# Altium schematic sheet PE.SchDoc: Architecture Diagram For Geec Power Electronics
size A3; Author: Conor Farrell; SheetNumber: 1; SheetTotal: 6
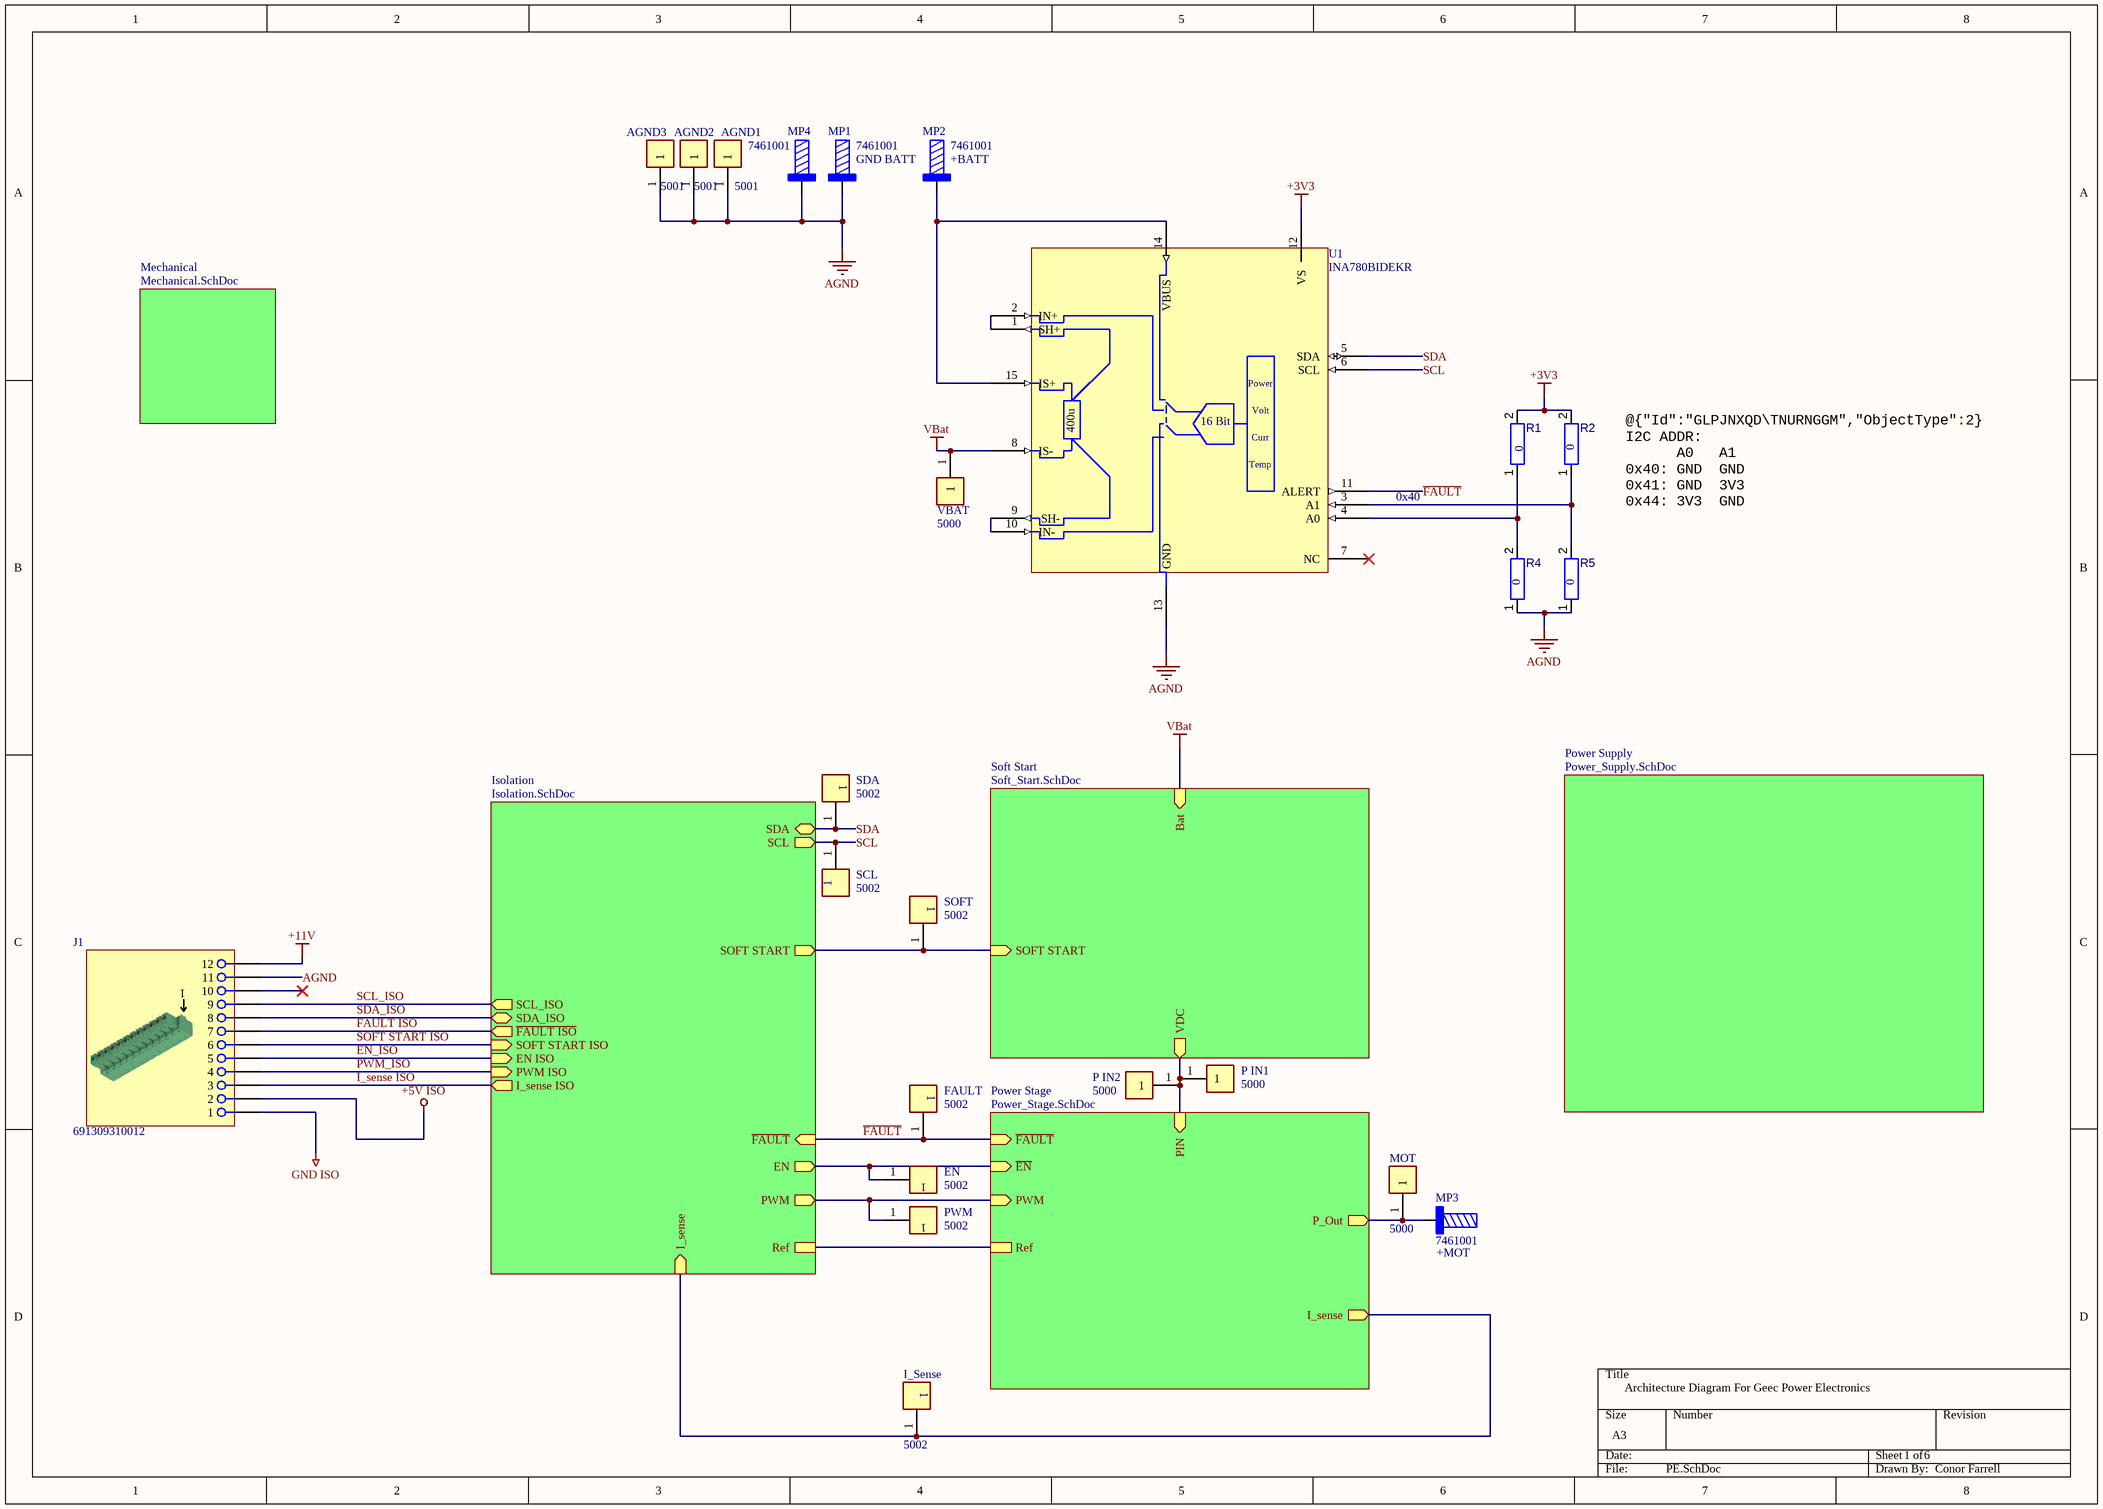
[diagram p0: PE.SchDoc]

## Parts
AGND1  5001  [FP-5001-MFG]
AGND2  5001  [FP-5001-MFG]
AGND3  5001  [FP-5001-MFG]
EN  5002  [FP-5002-MFG]
FAULT  5002  [FP-5002-MFG]
I_Sense  5002  [FP-5002-MFG]
J1  691309310012  [691309310012]
MOT  5000  [FP-5000-MFG]
MP1  7461001  [7461001_chemical surface]
MP2  7461001  [7461001_chemical surface]
MP3  7461001  [7461001_chemical surface]
MP4  7461001  [7461001_chemical surface]
P_IN1  5000  [FP-5000-MFG]
P_IN2  5000  [FP-5000-MFG]
PWM  5002  [FP-5002-MFG]
R1  value 0  [RESC3216X60X45NL15T20]  (hidden comment: 1206W4F0000T5E)
R2  value 0  [RESC3216X60X45NL15T20]  (hidden comment: 1206W4F0000T5E)
R4  value 0  [RESC3216X60X45NL15T20]  (hidden comment: 1206W4F0000T5E)
R5  value 0  [RESC3216X60X45NL15T20]  (hidden comment: 1206W4F0000T5E)
SCL  5002  [FP-5002-MFG]
SDA  5002  [FP-5002-MFG]
SOFT  5002  [FP-5002-MFG]
U1  INA780BIDEKR  [VQFN15_DEK_TEX]
VBAT  5000  [FP-5000-MFG]

## Sub-sheets
Isolation = Isolation.SchDoc: Ref, I_sense (in), PWM (out), ~{FAULT ISO} (out), ~{FAULT} (in), SOFT START ISO (in), SOFT START (out), SDA_ISO (bidir), SDA (bidir), SCL_ISO (out), SCL (out), PWM ISO (in), I_sense ISO (out), EN ISO (in), EN (out)
Mechanical = Mechanical.SchDoc: no entries
Power Stage = Power_Stage.SchDoc: PIN (in), Ref, I_sense (out), P_Out (out), ~{EN} (in), ~{FAULT} (in), PWM (in)
Power Supply = Power_Supply.SchDoc: no entries
Soft Start = Soft_Start.SchDoc: Bat (in), VDC (out), SOFT START (in)

## Nets
+3V3: R1.2 R2.2 U1.12(VS)
+5V ISO: J1.2
+11V: J1.12
AGND: AGND1.1 AGND2.1 AGND3.1 J1.11 MP1.1 MP4.1 R4.1 R5.1 U1.13(GND)
GND ISO: J1.1
VBat: U1.8(IS-) VBAT.1 ; sheet Soft Start/Bat
~{FAULT}: FAULT.1 U1.11(ALERT) ; sheet Isolation/~{FAULT}, sheet Power Stage/~{FAULT}
~{FAULT ISO}: J1.7 ; sheet Isolation/~{FAULT ISO}
EN_ISO: J1.5 ; sheet Isolation/EN ISO
I_sense ISO: J1.3 ; sheet Isolation/I_sense ISO
PWM_ISO: J1.4 ; sheet Isolation/PWM ISO
SCL: SCL.1 U1.6(SCL) ; sheet Isolation/SCL
SCL_ISO: J1.9 ; sheet Isolation/SCL_ISO
SDA: SDA.1 U1.5(SDA) ; sheet Isolation/SDA
SDA_ISO: J1.8 ; sheet Isolation/SDA_ISO
SOFT START ISO: J1.6 ; sheet Isolation/SOFT START ISO
NetEN_1: EN.1 ; sheet Isolation/EN, sheet Power Stage/~{EN}
NetI_Sense_1: I_Sense.1 ; sheet Isolation/I_sense, sheet Power Stage/I_sense
NetMOT_1: MOT.1 MP3.1 ; sheet Power Stage/P_Out
NetMP2_1: MP2.1 U1.14(VBUS) U1.15(IS+)
NetP_IN1_1: P_IN1.1 P_IN2.1 ; sheet Soft Start/VDC, sheet Power Stage/PIN
NetPWM_1: PWM.1 ; sheet Isolation/PWM, sheet Power Stage/PWM
NetR1_1: R1.1 R4.2 U1.4(A0)
NetR2_1: R2.1 R5.2 U1.3(A1)
NetSOFT_1: SOFT.1 ; sheet Soft Start/SOFT START, sheet Isolation/SOFT START
NetU1_1: U1.1(SH+) U1.2(IN+)
NetU1_9: U1.9(SH-) U1.10(IN-)
(unnamed): sheet Isolation/Ref, sheet Power Stage/Ref

Not connected (* = marked no-connect by the designer): J1 10*; U1 7(NC)*

## Notes on the sheet
- (near MP1) GND BATT
- (near MP2) +BATT
- 0x40
- @{"Id":"GLPJNXQD\TNURNGGM","ObjectType":2} I2C ADDR:
  A0   A1
  0x40: GND  GND
  0x41: GND  3V3
  0x44: 3V3  GND
  0x45: 3V3  3V3
- (near MP3) +MOT
- (in symbol CMP-004-000000-8) Power; Volt; 400u; 16 Bit; Curr; Temp

## Library data of the parts
AGND1-AGND3 = CMP-00030-00001-2: Test Point, Mini, Thm, Pc, .300 L, .100 Od, Heat Resistant Nylon 46, Black; Hole Diameter: 1.6mm; Color: Black; Pins: 1; Mounting Technology: PCB, Through Hole
EN FAULT I_Sense PWM SCL SDA SOFT = CMP-00030-00002-2: Test Point, Mini, Thm, Pc, .300 L, .100 Od, Heat Resistant Nylon 46, White; Hole Diameter: 1.6mm; Color: White; Mounting Technology: PCB, Through Hole
J1 = CMP-002-00074-3: Terminal Block, 3.81MM Pitch, Horizontal With Coding Finger, Tht, 12 Pins; pin to pad: 1>1A+1B 2>2A+2B 3>3A+3B 4>4A+4B 5>5A+5B 6>6A+6B 7>7A+7B 8>8A+8B 9>9A+9B 10>10A+10B 11>11A+11B 12>12A+12B; Gender: Female; System: Connector; MPN: 691309310012
MOT P_IN1 P_IN2 VBAT = CMP-00030-00004-2: Cable Wrap, 1/2 Inch, Polyethylene, Natural, 50 Ft, Spirap Series; Hole Diameter: 1.6mm; Mounting Technology: PCB, Through Hole; Color: Red
MP1-MP4 = CMP-002-00075-3: Pcb Terminal, Brass, Press-Fit Rohs Compliant: Yes; Current Rating: 130A; Height: 12mm; Max Operating Temperature: 150°C; Min Operating Temperature: -55°C; Pins: 9; Material: Brass
R1 R2 R4 R5 = CMP-009-00183-1: Thick Film Resistors - SMD RMC 1206 1/4W 1% T/R-5000; Case/Package: 1206; JLCPN: C17888
U1 = CMP-004-000000-8: 85-V 16-bit I²C-output digital power monitor with 400-ÂµOhm EZShunt Technology 15-VQFN -40 to 125; Manufacturer_Name: Texas Instruments; Copyright: Copyright (C) 2025 Ultra Librarian. All rights reserved.; Datasheet: https://www.ti.com/lit/gpn/ina780b; Type: Linear; Pins: 15; RefDes: RefDes; Manufacturer_Part_Number: PINA780BIDEKR; Design Item ID: PINA780BIDEKR; Source: PINA780BIDEKR.SchLib; Case/Package: VQFN; JLCPN: C34740774; MPN: INA780BIDEKR